# EAGLE design schematic (EAGLE 6.5.0)
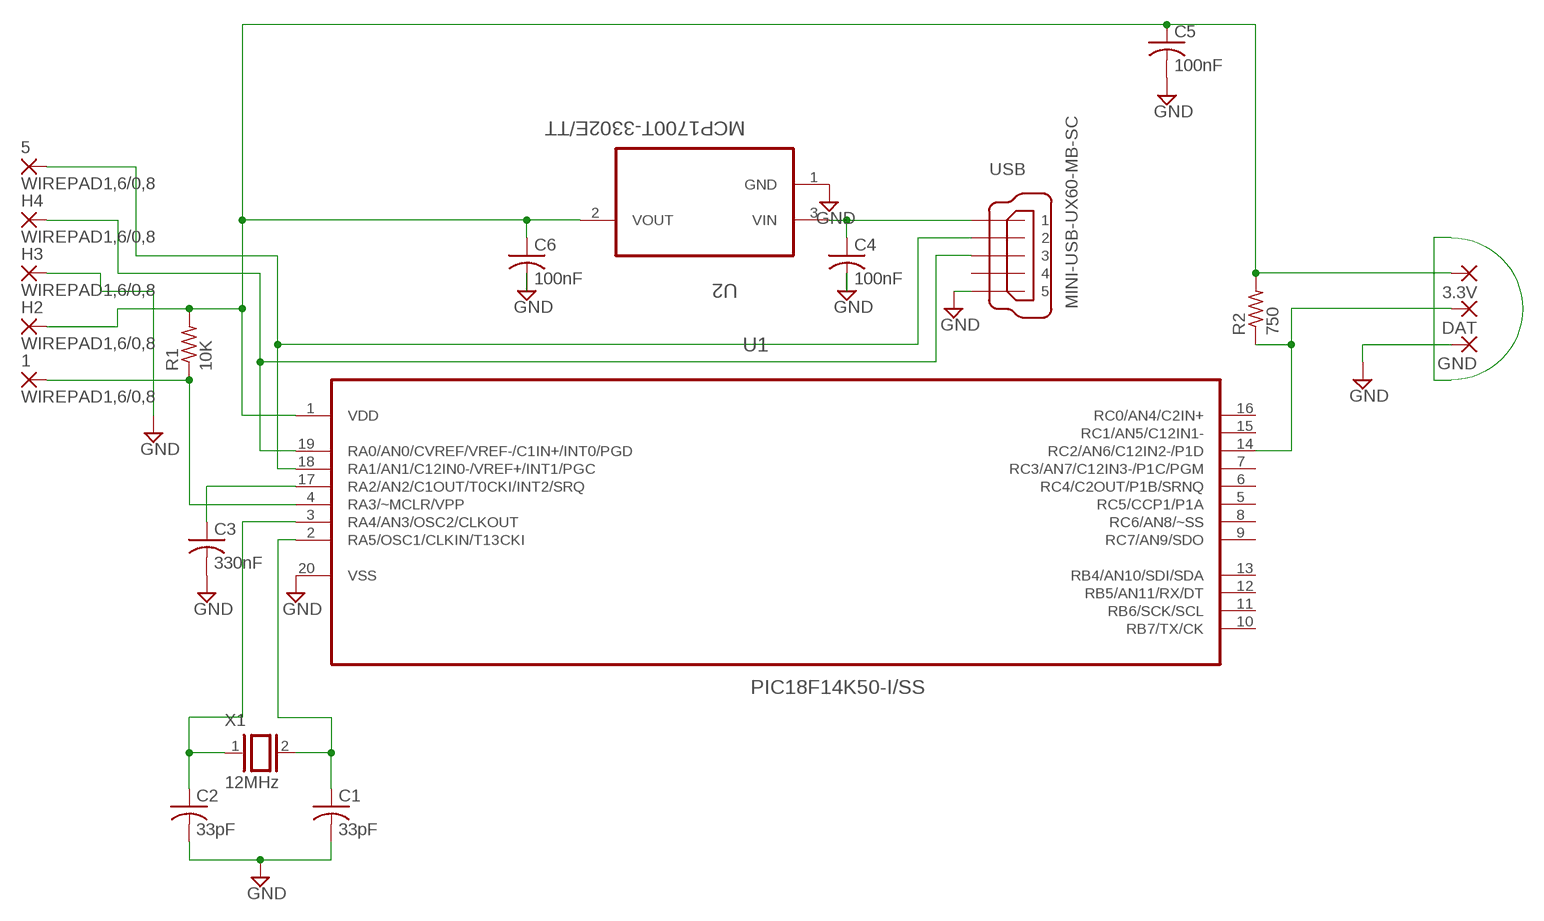
[diagram p0: schematic, sheet 1]

## Parts
1  WIREPAD1,6/0,8  [1,6/0,8]
3.3V  SMD2  [SMD1,27-2,54]
5  WIREPAD1,6/0,8  [1,6/0,8]
C1  33pF  C-USC0402  [C0402]
C2  33pF  C-USC0402  [C0402]
C3  330nF  C-USC0603  [C0603]
C4  100nF  C-USC0402  [C0402]
C5  100nF  C-USC0402  [C0402]
C6  100nF  C-USC0402  [C0402]
DAT  SMD2  [SMD1,27-2,54]
GND  SMD2  [SMD1,27-2,54]
H2  WIREPAD1,6/0,8  [1,6/0,8]
H3  WIREPAD1,6/0,8  [1,6/0,8]
H4  WIREPAD1,6/0,8  [1,6/0,8]
R1  10K  R-US_R0805  [R0805]
R2  750  R-US_R0805  [R0805]
U1  PIC18F14K50-I/SS  [SOP65P780X200-20N]
U2  MCP1700T-3302E/TT  [SOT95P237X112-3N]
USB  MINI-USB-UX60-MB-SC  [UX60-MB-SC]
X1  12MHz  XTAL/S  [QS]

## Nets
GND: C1.2 C2.2 C3.2 C4.2 C5.2 C6.2 GND.1(P) H3.1(P) U1.20(VSS) U2.1(GND) USB.P$5
N$1: C4.1 U2.3(VIN) USB.P$1
N$2: 3.3V.1(P) C5.1 C6.1 H2.1(P) R1.2 R2.2 U1.1(VDD) U2.2(VOUT)
N$5: 1.1(P) R1.1 U1.4(RA3/~MCLR/VPP)
N$6: C3.1 U1.17(RA2/AN2/C1OUT/T0CKI/INT2/SRQ)
N$7: C1.1 U1.2(RA5/OSC1/CLKIN/T13CKI) X1.2
N$8: C2.1 U1.3(RA4/AN3/OSC2/CLKOUT) X1.1
N$12: DAT.1(P) R2.1 U1.14(RC2/AN6/C12IN2-/P1D)
N$13: 5.1(P) U1.18(RA1/AN1/C12IN0-/VREF+/INT1/PGC) USB.P$2
N$14: H4.1(P) U1.19(RA0/AN0/CVREF/VREF-/C1IN+/INT0/PGD) USB.P$3
Unconnected: U1.5(RC5/CCP1/P1A) U1.6(RC4/C2OUT/P1B/SRNQ) U1.7(RC3/AN7/C12IN3-/P1C/PGM) U1.8(RC6/AN8/~SS) U1.9(RC7/AN9/SDO) U1.10(RB7/TX/CK) U1.11(RB6/SCK/SCL) U1.12(RB5/AN11/RX/DT) U1.13(RB4/AN10/SDI/SDA) U1.15(RC1/AN5/C12IN1-) U1.16(RC0/AN4/C2IN+) USB.P$4

## Library data of the parts
1 5 H2-H4 = wirepad:WIREPAD: Wire PAD connect wire on PCB
3.3V DAT GND = wirepad:SMD2: SMD PAD
C1-C6 = rcl:C-US: CAPACITOR, American symbol
R1 R2 = resistor:R-US_: RESISTOR, American symbol
U1 = Microchip_By_element14_Batch_1:PIC18F14K50-I/SS: Flash Microcontrollers; MPN: PIC18F14K50-I/SS; OC_FARNELL: 1648504; OC_NEWARK: 77M3105; PACKAGE: SOP-20; SUPPLIER: Microchip
U2 = microchip:MCP1700T-3302E/TT: Low Quiescent Current LDO; MPN: MCP1700T-3302E/TT; OC_FARNELL: 1296592; OC_NEWARK: 88H9817; PACKAGE: SOT23-3; SUPPLIER: Microchip
USB = Ian_Custom:MINI-USB-: MINI USB Connector Source: http://www.hirose.co.jp/cataloge_hp/e24000019.pdf
X1 = special:XTAL/S: CRYSTAL

## Net classes
0 default: width 0.254 mm, drill 0.61 mm, clearance 0.203 mm

## Board
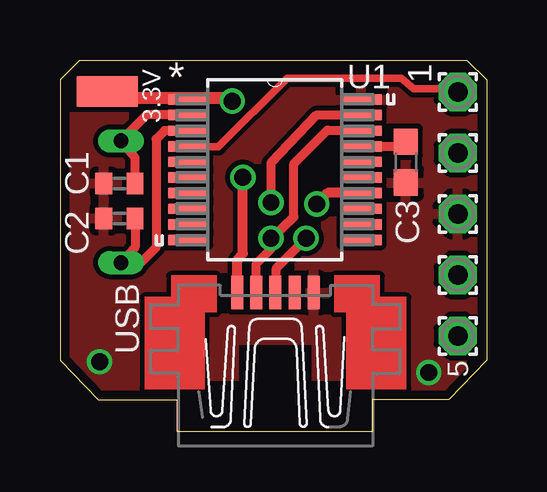
[diagram p1: board, top side]
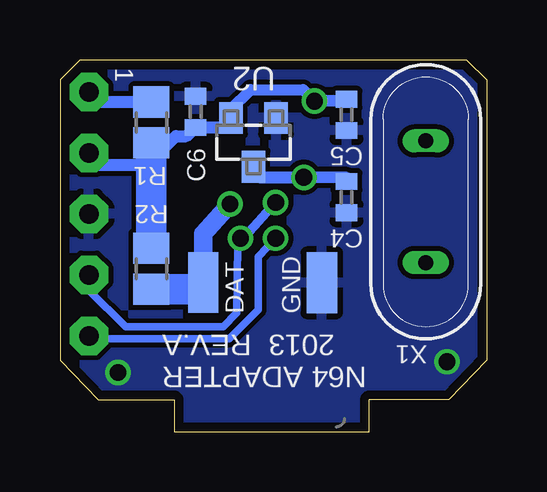
[diagram p2: board, bottom side, seen from below]

Size 17.78 x 15.49 mm. Coordinates in mm from the lower left corner, seen from the top.
Outline: 0,14.67 0,2.98 1.59,1.33 4.89,1.33 4.89,0 13.02,0 13.02,1.33 16.19,1.33 17.78,2.98 17.78,14.67 16.95,15.49 0.83,15.49 0,14.67
Copper layers (1*16): Top 0.0356mm / dielectric 1.5011mm / Bottom 0.0356mm
Design rules "LaenPCBOrder": minimum track width 6mil, minimum drill 13mil, track to track 6mil, track to pad 6mil, pad to pad 6mil, via to via 6mil, smd to smd 6mil, copper to edge 15mil, drill to drill 6mil, minimum pad ring 7mil, minimum via ring 7mil, stop-mask expansion 4mil, vias tented up to drill 0mil, thermal gap 10mil

### Footprints (pad centres in the part's own frame; a part is rotated, then mirrored left to right if it is on the bottom)
1,6/0,8 = drill 0.813 pad 1.6 octagon: 1 0,0
SMD1,27-2,54 = smd 1.27 x 2.54: 1 0,0
C0402 = smd 0.7 x 0.9: 1 -0.65,0; 2 0.65,0
C0603 = smd 1.1 x 1: 1 -0.85,0; 2 0.85,0
R0805 = smd 1.3 x 1.5: 1 -0.85,0; 2 0.85,0
SOP65P780X200-20N = smd 1.676 x 0.432: 1 -3.607,2.921; 2 -3.607,2.286; 3 -3.607,1.626; 4 -3.607,0.965; 5 -3.607,0.33; 6 -3.607,-0.33; 7 -3.607,-0.965; 8 -3.607,-1.626; 9 -3.607,-2.286; 10 -3.607,-2.921; 11 3.607,-2.921; 12 3.607,-2.286; 13 3.607,-1.626; 14 3.607,-0.965; 15 3.607,-0.33; 16 3.607,0.33; 17 3.607,0.965; 18 3.607,1.626; 19 3.607,2.286; 20 3.607,2.921
SOT95P237X112-3N = smd 0.991 x 1.321: 1 -0.94,-1.016; 2 0.94,-1.016; 3 0,1.016
UX60-MB-SC = smd 0.5 x 1.4: P$1 -1.55,2.5; P$2 -0.75,2.5; P$3 0.05,2.5; P$4 0.85,2.5; P$5 1.65,2.5
QS = drill 0.61 long: 1 -2.54,0; 2 2.54,0

### Placement (x,y rotation side)
1  16.57,14.16 0 top
3.3V  1.97,14.18 270 top
5  16.57,4 0 top
C1  2.48,10.35 180 top
C2  2.48,8.89 180 top
C3  14.41,11.24 270 top
C4  5.84,9.78 270 bottom
C5  5.84,13.21 270 bottom
C6  12.13,13.33 90 bottom
DAT  11.81,6.22 180 bottom
GND  6.87,6.21 0 bottom
H2  16.57,11.62 0 top
H3  16.57,9.08 0 top
H4  16.57,6.54 0 top
R1  13.97,12.89 270 bottom
R2  13.97,6.79 90 bottom
U1  8.95,10.92 0 top
U2  9.72,12.06 180 bottom
USB  8.93,3.3 0 top
X1  2.54,9.59 90 bottom

### Tracks (layer width: path | path; a pad name or v marks a point on that pad's centre or on a via)
GND  (via drill 0.7 pad 0.41)
  Top 0.254: U1.20 12.83,13.84 12.88,13.84
  other vias: 1.65,2.92 15.37,2.48
  pour Top: -2.16,19.68 19.24,19.75 19.11,-1.84 -2.29,-1.9
  pour Bottom: -2.22,19.68 -2.29,-1.9 19.18,-1.9 19.24,19.68
N$1  (via drill 0.7 pad 0.41)
  Top 0.406: USB.P$1 7.38,7.12 7.62,7.43 v7.62,10.61
  Bottom 0.508: U2.3 9.43,10.61 v7.62,10.61 | C4.1 5.84,10.59 v7.62,10.61 | 7.49,10.41 v7.62,10.61
N$2  (via drill 0.7 pad 0.41)
  Top 0.305: U1.1 5.78,13.84 5.78,13.91
  Top 0.381: 7.37,13.91 v7.18,13.78
  Top 0.508: 7.37,13.91 5.78,13.91 1.72,13.91 3.3V.1
  Bottom 0.381: U2.2 10.77,13.13 | R1.2 14.16,11.11 | C5.1 5.98,13.79
  Bottom 0.406: R1.2 14.1,10.71 | 10.65,12.68 U2.2
  Bottom 0.457: U2.2 10.65,13.44 9.84,14.26 7.65,14.26 v7.18,13.78
  Bottom 0.508: 10.65,12.68 C6.1 12.52,12.32 12.95,12.32 14.16,11.11 16.57,11.11 H2.1 | 14.1,10.71 13.97,11.28 14.22,10.71 | 5.98,13.79 v7.18,13.78
  Bottom 1.27: 13.97,11.28 R2.2
N$5
  Top 0.305: 1.1 16.45,14.29 14.73,14.29 14.22,14.73 9.46,14.73 6.6,11.87 5.4,11.87 U1.4
  Bottom 0.508: R1.1 16.57,13.74 1.1
N$6
  Top 0.381: C3.1 14.67,11.89 U1.17
N$7
  Top 0.305: 2.73,12.19 X1.2
  Top 0.381: C1.1 3.13,11.41 X1.2 3.62,13.21 U1.2
N$8
  Top 0.381: U1.3 4.36,12.55 4,12.19 4,7.68 3.37,7.05 X1.1 3.13,7.7 C2.1
N$12  (via drill 0.7)
  Top 0.406: U1.14 11.16,9.96 v10.7,9.49
  Bottom 0.508: 11.94,5.94 DAT.1
  Bottom 0.762: DAT.1 11.81,8.26 v10.7,9.49
  Bottom 1.27: R2.1 11.94,5.94
N$13  (via drill 0.7)
  Top 0.305: 12.84,12.51 U1.18
  Top 0.381: U1.18 12.54,12.57 11.14,12.57 9.75,11.18 9.75,8.95 v8.79,8.06 8.79,7.62 8.18,7 USB.P$2
  Bottom 0.305: 5.1 16.51,3.87 10.73,3.87 9.53,5.08 9.53,7.3 v8.79,8.06
N$14  (via drill 0.7)
  Top 0.305: 9.02,5.84 USB.P$3
  Top 0.381: v8.79,9.56 8.79,11.21 10.7,13.21 U1.19 | 9.02,5.84 9.02,6.83 v10.26,8.06
  Bottom 0.305: H4.1 16.57,5.91 15.05,4.38 10.99,4.38 10.41,4.95 10.38,7.84 10.38,8.03 v10.26,8.06 10.06,8.16
  Bottom 0.381: 10.06,8.16 v8.79,9.56

### Text on the board
bNames: 1 | N64 ADAPTER / 2013 REV.A